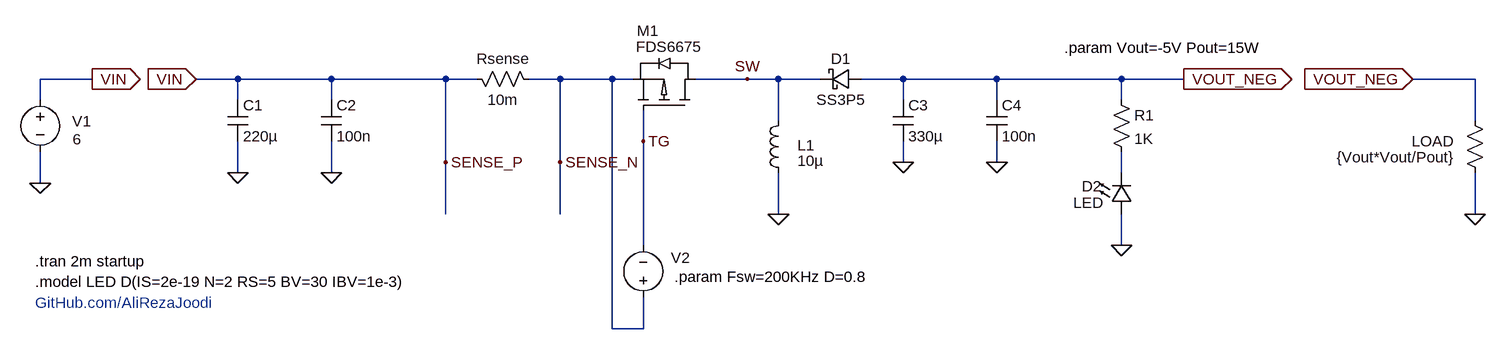
[diagram p0: schematic _PowerStage_PMOS_v2.0.asc]
_PowerStage_PMOS_v2.0.asc, the LTspice schematic file:
Version 4.1
SHEET 1 3996 1504
WIRE 1472 416 1392 416
WIRE 1696 416 1632 416
WIRE 1840 416 1696 416
WIRE 2016 416 1840 416
WIRE 2064 416 2016 416
WIRE 2192 416 2144 416
WIRE 2272 416 2192 416
WIRE 2304 416 2272 416
WIRE 2480 416 2400 416
WIRE 2528 416 2480 416
WIRE 2592 416 2528 416
WIRE 2720 416 2656 416
WIRE 2864 416 2720 416
WIRE 3056 416 2864 416
WIRE 3152 416 3056 416
WIRE 3600 416 3504 416
WIRE 1392 448 1392 416
WIRE 1696 448 1696 416
WIRE 1840 448 1840 416
WIRE 2720 448 2720 416
WIRE 2864 448 2864 416
WIRE 3056 448 3056 416
WIRE 2528 480 2528 416
WIRE 3600 480 3600 416
WIRE 2320 512 2320 464
WIRE 2016 544 2016 416
WIRE 2192 544 2192 416
WIRE 2720 544 2720 512
WIRE 2864 544 2864 512
WIRE 1696 560 1696 512
WIRE 1840 560 1840 512
WIRE 3056 560 3056 528
WIRE 1392 576 1392 528
WIRE 2016 624 2016 544
WIRE 2192 624 2192 544
WIRE 2528 624 2528 560
WIRE 3600 624 3600 560
WIRE 2320 672 2320 512
WIRE 3056 672 3056 624
WIRE 2272 800 2272 416
WIRE 2320 800 2320 752
WIRE 2320 800 2272 800
FLAG 3152 416 VOUT_NEG
IOPIN 3152 416 Out
FLAG 1472 416 VIN
IOPIN 1472 416 Out
FLAG 2480 416 SW
FLAG 2320 512 TG
FLAG 2016 544 SENSE_P
FLAG 2192 544 SENSE_N
FLAG 1632 416 VIN
IOPIN 1632 416 In
FLAG 3504 416 VOUT_NEG
IOPIN 3504 416 In
FLAG 1392 576 0
FLAG 1696 560 0
FLAG 1840 560 0
FLAG 2528 624 0
FLAG 2720 544 0
FLAG 2864 544 0
FLAG 3056 672 0
FLAG 3600 624 0
SYMBOL ind 2544 464 M0
WINDOW 0 -40 54 Left 2
WINDOW 3 -54 78 Left 2
SYMATTR InstName L1
SYMATTR Value 10µ
SYMATTR SpiceLine Rser=0.025
SYMBOL res 2048 400 M90
WINDOW 0 0 56 VBottom 2
WINDOW 3 32 56 VTop 2
SYMATTR InstName Rsense
SYMATTR Value 10m
SYMATTR SpiceLine tol=1
SYMBOL voltage 1392 432 R0
WINDOW 123 24 138 Left 2
WINDOW 39 24 117 Left 2
WINDOW 3 50 77 Left 2
WINDOW 0 49 49 Left 2
SYMATTR Value 6
SYMATTR InstName V1
SYMBOL res 3616 576 R180
WINDOW 0 48 64 Left 2
WINDOW 3 48 40 Left 2
SYMATTR InstName LOAD
SYMATTR Value {Vout*Vout/Pout}
SYMBOL cap 1824 448 R0
SYMATTR InstName C2
SYMATTR Value 100n
SYMATTR SpiceLine V=35
SYMBOL cap 2848 448 R0
SYMATTR InstName C4
SYMATTR Value 100n
SYMBOL schottky 2656 432 M270
WINDOW 0 32 32 VTop 2
WINDOW 3 0 32 VBottom 2
SYMATTR InstName D1
SYMATTR Value SS3P5
SYMBOL LED 3040 624 M180
WINDOW 0 -45 43 Left 2
WINDOW 3 -58 18 Left 2
SYMATTR InstName D2
SYMATTR Value LED
SYMBOL res 3040 432 R0
SYMATTR InstName R1
SYMATTR Value 1K
SYMBOL cap 1680 448 R0
SYMATTR InstName C1
SYMATTR Value 220µ
SYMATTR SpiceLine V=35
SYMBOL voltage 2320 768 M180
WINDOW 3 39 69 Invisible 2
WINDOW 123 0 0 Left 0
WINDOW 0 43 77 Left 2
SYMATTR Value PULSE(0 12 0 {0.01/Fsw} {0.01/Fsw} {D/Fsw} {1/Fsw})
SYMATTR InstName V2
SYMATTR SpiceLine Rser=10
SYMBOL cap 2704 448 R0
SYMATTR InstName C3
SYMATTR Value 330µ
SYMATTR SpiceLine V=35
SYMBOL MyLib\\Transistor_MOSFET_P\\MOSFET_P 2304 464 R270
WINDOW 0 122 6 VRight 2
WINDOW 3 98 5 VRight 2
SYMATTR InstName M1
SYMATTR Value FDS6675
TEXT 1384 696 Left 2 !.tran 2m startup
TEXT 1384 728 Left 2 !.model LED D(IS=2e-19 N=2 RS=5 BV=30 IBV=1e-3)
TEXT 1384 760 Left 2 ;GitHub.com/AliRezaJoodi
TEXT 2968 368 Left 2 !.param Vout=-5V Pout=15W
TEXT 2368 720 Left 2 !.param Fsw=200KHz D=0.8

The netlist it stands for:
* _PowerStage_PMOS_v2.0.asc
L1 SW 0 10µ Rser=0.025
Rsense SENSE_P SENSE_N 10m tol=1
V1 SENSE_P 0 6
R§LOAD 0 VOUT_NEG {Vout*Vout/Pout}
C2 SENSE_P 0 100n V=35
C4 VOUT_NEG 0 100n
D1 VOUT_NEG SW SS3P5
D2 0 N001 LED
R1 VOUT_NEG N001 1K
C1 SENSE_P 0 220µ V=35
V2 SENSE_N TG PULSE(0 12 0 {0.01/Fsw} {0.01/Fsw} {D/Fsw} {1/Fsw}) Rser=10
C3 VOUT_NEG 0 330µ V=35
M1 SW TG SENSE_N SENSE_N FDS6675
.model D D
.lib standard.dio
.model NMOS NMOS
.model PMOS PMOS
.lib standard.mos
.tran 2m startup
.model LED D(IS=2e-19 N=2 RS=5 BV=30 IBV=1e-3)
* GitHub.com/AliRezaJoodi
.param Vout=-5V Pout=15W
.param Fsw=200KHz D=0.8
.backanno
.end